# Altium schematic sheet TESTSCHEME.SchDoc
size A4
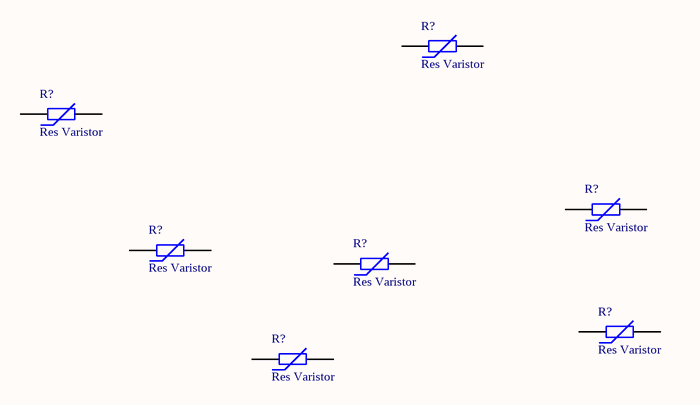
[diagram p0: TESTSCHEME.SchDoc]

## Parts
(Parts that share a designator on the sheet are numbered #1, #2 ... from top to bottom, then left to right.)
R?#1  Res Varistor  [6-0805_N]
R?#2  Res Varistor  [6-0805_N]
R?#3  Res Varistor  [6-0805_N]
R?#4  Res Varistor  [6-0805_N]
R?#5  Res Varistor  [6-0805_N]
R?#6  Res Varistor  [6-0805_N]
R?#7  Res Varistor  [6-0805_N]

## Nets

Not connected (* = marked no-connect by the designer): R?#1 1 2; R?#2 1 2; R?#3 1 2; R?#4 1 2; R?#5 1 2; R?#6 1 2; R?#7 1 2

## Library data of the parts
R?#1-R?#7 = Res Varistor: Varistor (Voltage-Sensitive Resistor); Published: 24-Mar-1999; LatestRevisionDate: 29-May-2009; LatestRevisionNote: IPC-7351 Footprint Added.; PackageVersion: Mar-2003; PackageReference: 6-0805; Publisher: Altium Limited; PackageDescription: Chip Resistor 0805 Case Size; Code_IPC: RESC2012